# Altium schematic sheet uklad_pomiaru_pradu.SchDoc
size A4; SheetNumber: 1; SheetTotal: 1
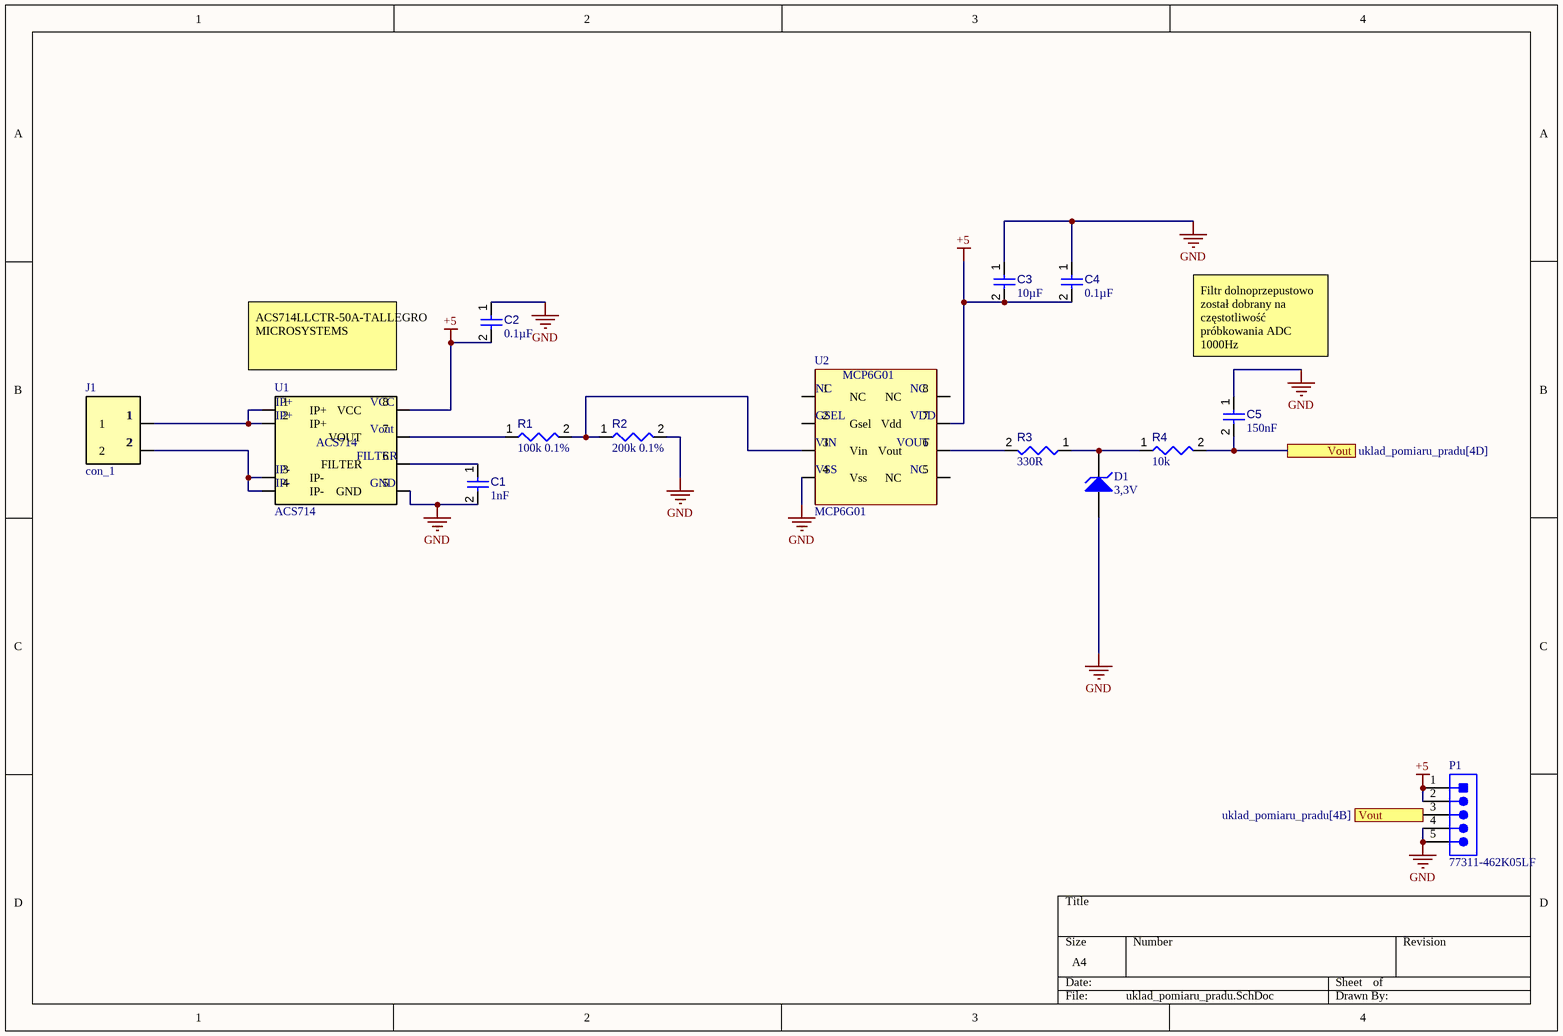
[diagram p0: uklad_pomiaru_pradu.SchDoc]

## Parts
C1  value 1nF  [CAPC2013X145X50ML20T25]  (hidden comment: Capacitor 1 uF +/- 10% 25 V 0805)
C2  value 0.1µF  [CAPC2013X145X50ML20T25]  (hidden comment: Capacitor 1 uF +/- 10% 25 V 0805)
C3  value 10µF  [CAPC2013X145X50ML20T25]  (hidden comment: Capacitor 1 uF +/- 10% 25 V 0805)
C4  value 0.1µF  [CAPC2013X145X50ML20T25]  (hidden comment: Capacitor 1 uF +/- 10% 25 V 0805)
C5  value 150nF  [CAPC2013X145X50ML20T25]  (hidden comment: Capacitor 1 uF +/- 10% 25 V 0805)
D1  3,3V  [FAIR-DO-35-2]
J1  con_1  [con_1]
P1  77311-462K05LF  [FCI-77311-5_V]
R1  value 100k 0.1%  [RESC3216X60X45ML15T20]  (hidden comment: Resistor 100k +/-1% 1206 250 mW)
R2  value 200k 0.1%  [RESC3216X60X45ML15T20]  (hidden comment: Resistor 100k +/-1% 1206 250 mW)
R3  value 330R  [RESC3216X60X45ML15T20]  (hidden comment: Resistor 100k +/-1% 1206 250 mW)
R4  value 10k  [RESC3216X60X45ML15T20]  (hidden comment: Resistor 100k +/-1% 1206 250 mW)
U1  ACS714  [SOIC127P600X175-8N]
U2  MCP6G01  [SOIC127P600X175-8N]

## Ports
Vout (see uklad_pomiaru_pradu[4B]), Vout (see uklad_pomiaru_pradu[4D])

## Nets
+5: C2.2 C3.2 C4.2 P1.1(DTR) P1.2(RXI) U1.8(VCC) U2.7(Vdd)
GND: C1.2 C2.1 C3.1 C4.1 C5.1 D1.1(A) P1.4(VCC) P1.5(CTS) R2.2 U1.5(GND) U2.4(Vss)
Vout: C5.2 P1.3(TXO) R4.2 ; port Vout
NetC1_1: C1.1 U1.6(FILTER)
NetD1_2: D1.2(K) R3.1 R4.1
NetJ1_1: J1.1 U1.1(IP+) U1.2(IP+)
NetJ1_2: J1.2 U1.3(IP-) U1.4(IP-)
NetR1_1: R1.1 U1.7(VOUT)
NetR1_2: R1.2 R2.1 U2.3(Vin)
NetR3_2: R3.2 U2.6(Vout)

Not connected (* = marked no-connect by the designer): U2 1(NC) 2(Gsel) 5(NC) 8(NC)

## Notes on the sheet
- (near U1) ACS714LLCTR-50A-TALLEGRO MICROSYSTEMS
- Filtr dolnoprzepustowo został dobrany na  częstotliwość próbkowania ADC 1000Hz
- (in symbol ACS714) Vout
- (in symbol MCP6G01) GSEL; VDD; VIN; VOUT; VSS

## Library data of the parts
C1-C5 = CMP-001-00010-6: Chip Capacitor, 1 uF, +/-10%, 25 V, 0805 (2012 Metric); Capacitor Type: Ceramic; Voltage Rating: 25V; RoHS Compliant: True; Pins: 2; Mounting Technology: SM; Max Operating Temperature: 125°C; Min Operating Temperature: -55°C; Tolerance: 10%; Case/Package: 0805
D1 = CMP-004-00021-2: Zener Diode, 3.6 V, 5 mA, -65 to 200 degC, 2-Pin DO-35, RoHS, Bulk; Manufacturer: Fairchild Semiconductor; Tolerance: 6%; Power: 500mW; Forward Voltage: 1.5V; Impedance: 90Ohm; Package Quantity: 1000; Min Operating Temperature: -65°C; Datasheet Version: Rev. C1, 07/2007; Max Operating Temperature: 200°C; Mounting Technology: TH; Package Description: 2-Pin Through Hole Diode, Dia 1.72 mm, Body Length 3.805 mm; RoHS Compliant: True; Manufacturer URL: https://www.fairchildsemi.com/; Package Reference: DO-35-2; Case/Package: DO-35-2; Datasheet URL: https://www.fairchildsemi.com/datasheets/BZ/BZX79C3V6.pdf; Package URL: https://www.fairchildsemi.com/package-drawings/DO/DO35A.pdf; Pins: 2; Packaging: Bulk
P1 = CMP-002-00021-2: Male Header, Pitch 2.54 mm, 1 x 5 Position, Height 16.24 mm, Tail Length 3.05 mm, -65 to 125 degC, RoHS, Tape and Reel; Manufacturer: FCI Electronics; Connector Type: Header; Manufacturer URL: http://portal.fciconnect.com/; Datasheet URL: http://portal.fciconnect.com/Comergent//fci/drawing/77311.pdf; Gender: Male; Case/Package: 77311-5; Package Reference: 77311-5; Datasheet Version: Rev. CK, 07/2016; Package Description: Male Header, Pitch 2.54 mm, 1 x 5 Position, Height 16.24 mm, Tail Length 3.05 mm; RoHS Compliant: Unknown; Mounting Technology: TH
R1-R4 = CMP-009-00025-5: Chip Resistor, 100 KOhm, +/- 1%, 0.25 W, -55 to 155 degC, 1206 (3216 Metric); Voltage Rating: 200V; Power: 250mW; RoHS Compliant: True; Max Operating Temperature: 155°C; Pins: 2; Tolerance: 1%; Mounting Technology: SM; Case/Package: 1206; Min Operating Temperature: -55°C